# Altium schematic sheet BLOCK_DETAIL.SchDoc
size 393 x 281 mm; SheetNumber: 2; SheetTotal: 6
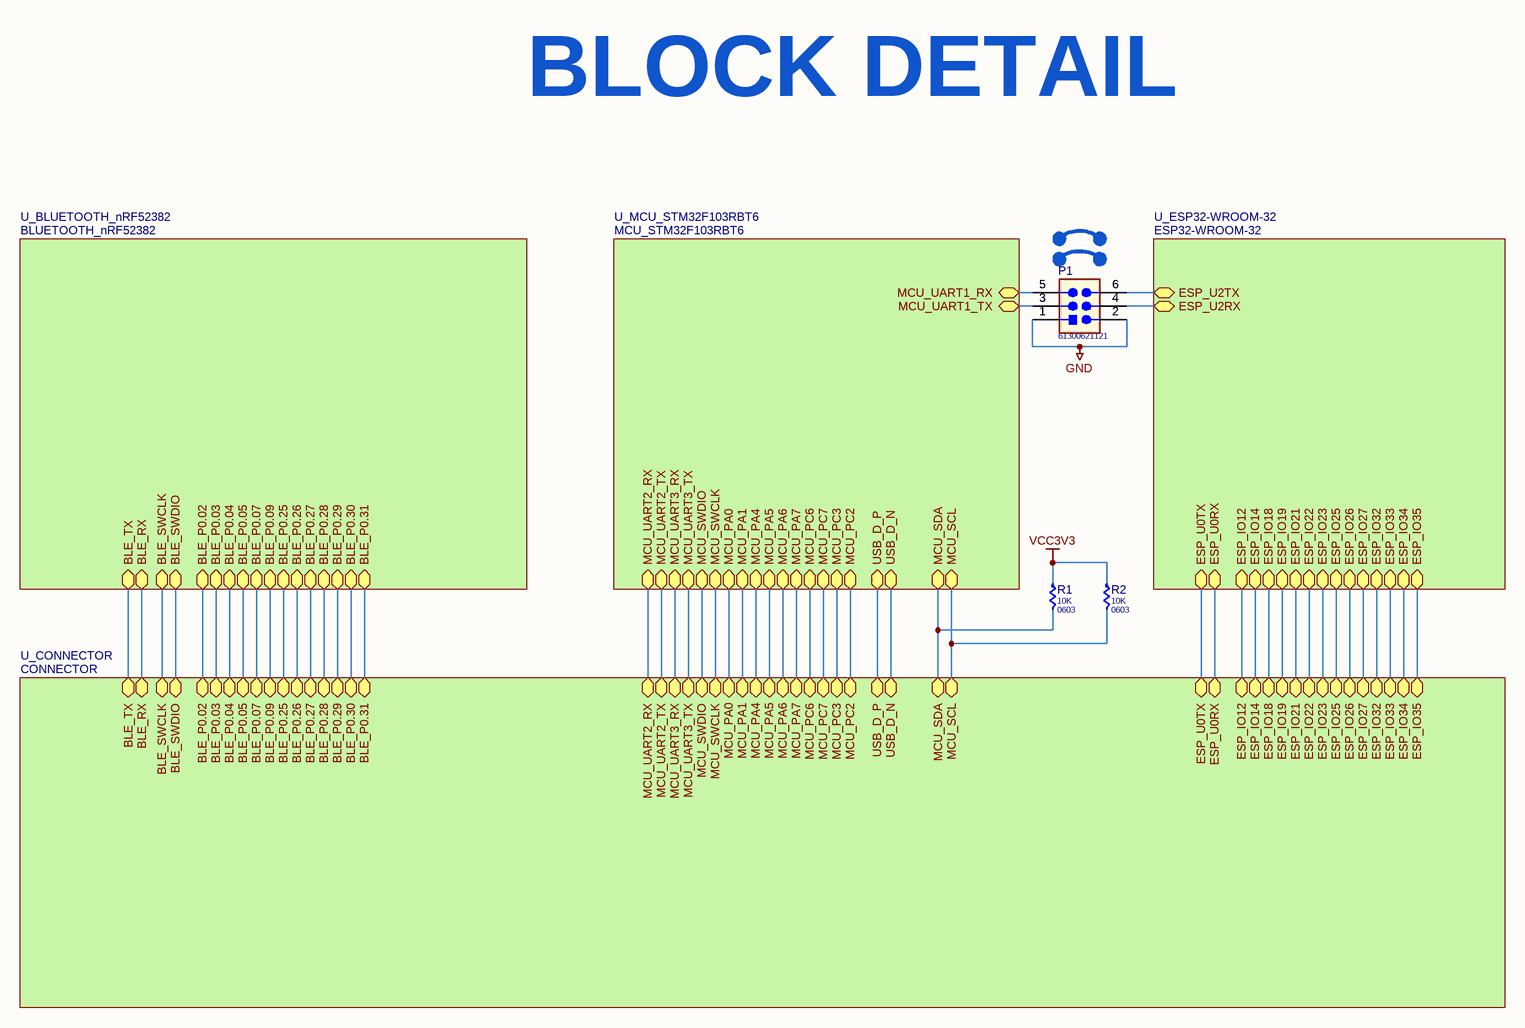
[diagram p0: BLOCK_DETAIL.SchDoc]

## Parts
P1  61300621121  [CON_6_2.54P]
R1  value 10K  PACK: 0603  [R0603]  (hidden comment: 10K 0603)
R2  value 10K  PACK: 0603  [R0603]  (hidden comment: 10K 0603)

## Sub-sheets
U_BLUETOOTH_nRF52382 = BLUETOOTH_nRF52382: BLE_TX (bidir), BLE_RX (bidir), BLE_SWCLK (bidir), BLE_SWDIO (bidir), BLE_P0.07 (bidir), BLE_P0.04 (bidir), BLE_P0.05 (bidir), BLE_P0.02 (bidir), BLE_P0.03 (bidir), BLE_P0.09 (bidir), BLE_P0.30 (bidir), BLE_P0.26 (bidir), BLE_P0.29 (bidir), BLE_P0.28 (bidir), BLE_P0.25 (bidir), BLE_P0.31 (bidir), BLE_P0.27 (bidir)
U_CONNECTOR = CONNECTOR: BLE_SWCLK (bidir), MCU_SWCLK (bidir), MCU_SWDIO (bidir), BLE_RX (bidir), BLE_TX (bidir), BLE_SWDIO (bidir), MCU_UART2_RX (bidir), MCU_UART2_TX (bidir), MCU_UART3_TX (bidir), MCU_UART3_RX (bidir), MCU_PA0 (bidir), MCU_PA4 (bidir), MCU_PA5 (bidir), MCU_PA6 (bidir), MCU_PA7 (bidir), MCU_PC6 (bidir), MCU_PC7 (bidir), ESP_U0TX (bidir), MCU_PA1 (bidir), ESP_U0RX (bidir), ESP_IO27 (bidir), ESP_IO19 (bidir), ESP_IO18 (bidir), BLE_P0.25 (bidir), BLE_P0.26 (bidir), BLE_P0.27 (bidir), BLE_P0.31 (bidir), BLE_P0.28 (bidir), BLE_P0.29 (bidir), BLE_P0.30 (bidir), BLE_P0.05 (bidir), BLE_P0.07 (bidir), BLE_P0.09 (bidir), BLE_P0.02 (bidir), BLE_P0.03 (bidir), BLE_P0.04 (bidir), ESP_IO21 (bidir), ESP_IO22 (bidir), ESP_IO25 (bidir), ESP_IO33 (bidir), ESP_IO23 (bidir), ESP_IO32 (bidir), ESP_IO26 (bidir), MCU_PC3 (bidir), MCU_PC2 (bidir), MCU_SCL (bidir), MCU_SDA (bidir), ESP_IO12 (bidir), ESP_IO34 (bidir), ESP_IO35 (bidir), ESP_IO14 (bidir), USB_D_P (bidir), USB_D_N (bidir)
U_ESP32-WROOM-32 = ESP32-WROOM-32: ESP_U2TX (bidir), ESP_U2RX (bidir), ESP_U0TX (bidir), ESP_U0RX (bidir), ESP_IO21 (bidir), ESP_IO27 (bidir), ESP_IO19 (bidir), ESP_IO18 (bidir), ESP_IO25 (bidir), ESP_IO23 (bidir), ESP_IO22 (bidir), ESP_IO26 (bidir), ESP_IO33 (bidir), ESP_IO32 (bidir), ESP_IO12 (bidir), ESP_IO35 (bidir), ESP_IO34 (bidir), ESP_IO14 (bidir)
U_MCU_STM32F103RBT6 = MCU_STM32F103RBT6: MCU_UART1_TX (bidir), MCU_UART1_RX (bidir), MCU_PC6 (bidir), MCU_PC7 (bidir), MCU_PA4 (bidir), MCU_PA5 (bidir), MCU_PA6 (bidir), MCU_PA7 (bidir), MCU_SWDIO (bidir), MCU_SWCLK (bidir), MCU_UART3_RX (bidir), MCU_UART3_TX (bidir), MCU_PA0 (bidir), MCU_UART2_TX (bidir), MCU_UART2_RX (bidir), MCU_PA1 (bidir), MCU_SDA (bidir), MCU_SCL (bidir), MCU_PC2 (bidir), MCU_PC3 (bidir), USB_D_N (bidir), USB_D_P (bidir)

## Nets
GND: P1.1 P1.2
VCC3V3: R1.1 R2.1
NetP1_3: P1.3 ; sheet U_MCU_STM32F103RBT6/MCU_UART1_TX
NetP1_4: P1.4 ; sheet U_ESP32-WROOM-32/ESP_U2RX
NetP1_5: P1.5 ; sheet U_MCU_STM32F103RBT6/MCU_UART1_RX
NetP1_6: P1.6 ; sheet U_ESP32-WROOM-32/ESP_U2TX
NetR1_2: R1.2 ; sheet U_MCU_STM32F103RBT6/MCU_SDA, sheet U_CONNECTOR/MCU_SDA
NetR2_2: R2.2 ; sheet U_MCU_STM32F103RBT6/MCU_SCL, sheet U_CONNECTOR/MCU_SCL
(unnamed): sheet U_BLUETOOTH_nRF52382/BLE_TX, sheet U_CONNECTOR/BLE_TX
(unnamed): sheet U_BLUETOOTH_nRF52382/BLE_RX, sheet U_CONNECTOR/BLE_RX
(unnamed): sheet U_BLUETOOTH_nRF52382/BLE_SWCLK, sheet U_CONNECTOR/BLE_SWCLK
(unnamed): sheet U_BLUETOOTH_nRF52382/BLE_SWDIO, sheet U_CONNECTOR/BLE_SWDIO
(unnamed): sheet U_BLUETOOTH_nRF52382/BLE_P0.07, sheet U_CONNECTOR/BLE_P0.07
(unnamed): sheet U_BLUETOOTH_nRF52382/BLE_P0.04, sheet U_CONNECTOR/BLE_P0.04
(unnamed): sheet U_BLUETOOTH_nRF52382/BLE_P0.05, sheet U_CONNECTOR/BLE_P0.05
(unnamed): sheet U_BLUETOOTH_nRF52382/BLE_P0.02, sheet U_CONNECTOR/BLE_P0.02
(unnamed): sheet U_BLUETOOTH_nRF52382/BLE_P0.03, sheet U_CONNECTOR/BLE_P0.03
(unnamed): sheet U_BLUETOOTH_nRF52382/BLE_P0.09, sheet U_CONNECTOR/BLE_P0.09
(unnamed): sheet U_BLUETOOTH_nRF52382/BLE_P0.30, sheet U_CONNECTOR/BLE_P0.30
(unnamed): sheet U_BLUETOOTH_nRF52382/BLE_P0.26, sheet U_CONNECTOR/BLE_P0.26
(unnamed): sheet U_BLUETOOTH_nRF52382/BLE_P0.29, sheet U_CONNECTOR/BLE_P0.29
(unnamed): sheet U_BLUETOOTH_nRF52382/BLE_P0.28, sheet U_CONNECTOR/BLE_P0.28
(unnamed): sheet U_BLUETOOTH_nRF52382/BLE_P0.25, sheet U_CONNECTOR/BLE_P0.25
(unnamed): sheet U_BLUETOOTH_nRF52382/BLE_P0.31, sheet U_CONNECTOR/BLE_P0.31
(unnamed): sheet U_BLUETOOTH_nRF52382/BLE_P0.27, sheet U_CONNECTOR/BLE_P0.27
(unnamed): sheet U_ESP32-WROOM-32/ESP_U0TX, sheet U_CONNECTOR/ESP_U0TX
(unnamed): sheet U_ESP32-WROOM-32/ESP_U0RX, sheet U_CONNECTOR/ESP_U0RX
(unnamed): sheet U_ESP32-WROOM-32/ESP_IO21, sheet U_CONNECTOR/ESP_IO21
(unnamed): sheet U_ESP32-WROOM-32/ESP_IO27, sheet U_CONNECTOR/ESP_IO27
(unnamed): sheet U_ESP32-WROOM-32/ESP_IO19, sheet U_CONNECTOR/ESP_IO19
(unnamed): sheet U_ESP32-WROOM-32/ESP_IO18, sheet U_CONNECTOR/ESP_IO18
(unnamed): sheet U_ESP32-WROOM-32/ESP_IO25, sheet U_CONNECTOR/ESP_IO25
(unnamed): sheet U_ESP32-WROOM-32/ESP_IO23, sheet U_CONNECTOR/ESP_IO23
(unnamed): sheet U_ESP32-WROOM-32/ESP_IO22, sheet U_CONNECTOR/ESP_IO22
(unnamed): sheet U_ESP32-WROOM-32/ESP_IO26, sheet U_CONNECTOR/ESP_IO26
(unnamed): sheet U_ESP32-WROOM-32/ESP_IO33, sheet U_CONNECTOR/ESP_IO33
(unnamed): sheet U_ESP32-WROOM-32/ESP_IO32, sheet U_CONNECTOR/ESP_IO32
(unnamed): sheet U_ESP32-WROOM-32/ESP_IO12, sheet U_CONNECTOR/ESP_IO12
(unnamed): sheet U_ESP32-WROOM-32/ESP_IO35, sheet U_CONNECTOR/ESP_IO35
(unnamed): sheet U_ESP32-WROOM-32/ESP_IO34, sheet U_CONNECTOR/ESP_IO34
(unnamed): sheet U_ESP32-WROOM-32/ESP_IO14, sheet U_CONNECTOR/ESP_IO14
(unnamed): sheet U_MCU_STM32F103RBT6/MCU_PC6, sheet U_CONNECTOR/MCU_PC6
(unnamed): sheet U_MCU_STM32F103RBT6/MCU_PC7, sheet U_CONNECTOR/MCU_PC7
(unnamed): sheet U_MCU_STM32F103RBT6/MCU_PA4, sheet U_CONNECTOR/MCU_PA4
(unnamed): sheet U_MCU_STM32F103RBT6/MCU_PA5, sheet U_CONNECTOR/MCU_PA5
(unnamed): sheet U_MCU_STM32F103RBT6/MCU_PA6, sheet U_CONNECTOR/MCU_PA6
(unnamed): sheet U_MCU_STM32F103RBT6/MCU_PA7, sheet U_CONNECTOR/MCU_PA7
(unnamed): sheet U_MCU_STM32F103RBT6/MCU_SWDIO, sheet U_CONNECTOR/MCU_SWDIO
(unnamed): sheet U_MCU_STM32F103RBT6/MCU_SWCLK, sheet U_CONNECTOR/MCU_SWCLK
(unnamed): sheet U_MCU_STM32F103RBT6/MCU_UART3_RX, sheet U_CONNECTOR/MCU_UART3_RX
(unnamed): sheet U_MCU_STM32F103RBT6/MCU_UART3_TX, sheet U_CONNECTOR/MCU_UART3_TX
(unnamed): sheet U_MCU_STM32F103RBT6/MCU_PA0, sheet U_CONNECTOR/MCU_PA0
(unnamed): sheet U_MCU_STM32F103RBT6/MCU_UART2_TX, sheet U_CONNECTOR/MCU_UART2_TX
(unnamed): sheet U_MCU_STM32F103RBT6/MCU_UART2_RX, sheet U_CONNECTOR/MCU_UART2_RX
(unnamed): sheet U_MCU_STM32F103RBT6/MCU_PA1, sheet U_CONNECTOR/MCU_PA1
(unnamed): sheet U_MCU_STM32F103RBT6/MCU_PC2, sheet U_CONNECTOR/MCU_PC2
(unnamed): sheet U_MCU_STM32F103RBT6/MCU_PC3, sheet U_CONNECTOR/MCU_PC3
(unnamed): sheet U_MCU_STM32F103RBT6/USB_D_N, sheet U_CONNECTOR/USB_D_N
(unnamed): sheet U_MCU_STM32F103RBT6/USB_D_P, sheet U_CONNECTOR/USB_D_P

## Notes on the sheet
- BLOCK DETAIL
- Title:
- Size:
- A3
- Date Modified:
- Document Number:
- Rev:
- Engineer:
- Sheet
- Of

## Library data of the parts
P1 = CON_2x3: CON C2B 2R8C M 2.54P THR; MGR: Würth Elektronik; Group: CON C2B; Unit: PCS; ROW: 2; COL: 3; PITCH: 2.54; TYPE: CON; Line Type: THR; Mounting Type: DIP; PHX PN: *; PHX CODE: *; NOTE: *; SAP code: *; Part Code: *; Part Type: EP; M/F: M; PACK: 2.54P; MGR PN: 61300621121
R1 R2 = R0603_10K_1/10W_1%: RES CHP 10K 1% 1/10W 0603 SMD; MGR: PANASONIC; MGR PN: ERJ-3EKF1002V; Group: RES CHP; Line Type: SMT; Unit: PCS; TYPE: RES; Mounting Type: SMD; PHX PN: *; PHX CODE: *; NOTE: *; SAP code: *; Part Code: *; Part Type: EP; POWER: 1/10W; TOLERANCE: 1%